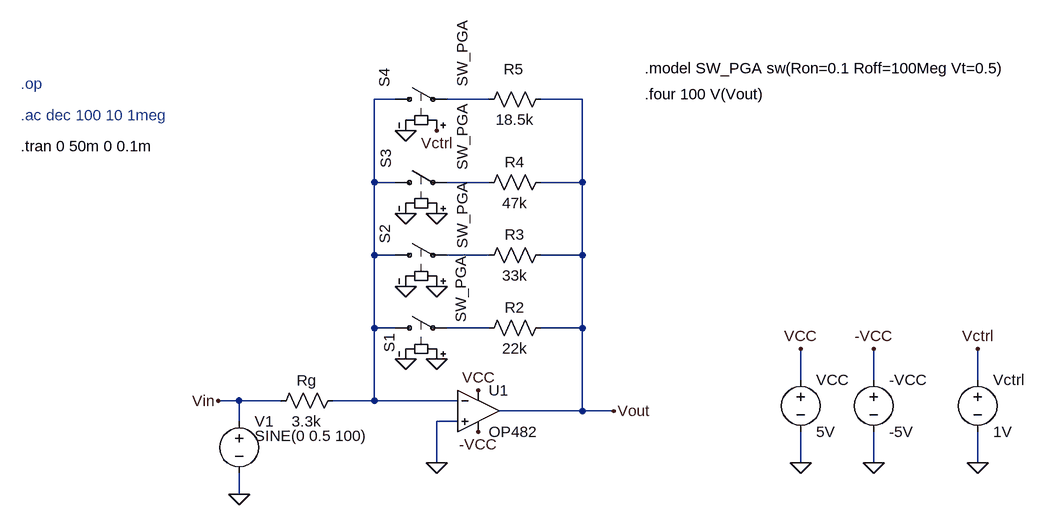
[diagram p0: schematic Etaj3.asc]
Etaj3.asc, the LTspice schematic file:
Version 4
SHEET 1 1272 680
WIRE 240 -96 208 -96
WIRE 384 -96 320 -96
WIRE 528 -96 464 -96
WIRE 208 32 208 -96
WIRE 240 32 208 32
WIRE 384 32 320 32
WIRE 528 32 528 -96
WIRE 528 32 464 32
WIRE 208 144 208 32
WIRE 240 144 208 144
WIRE 384 144 320 144
WIRE 528 144 528 32
WIRE 528 144 464 144
WIRE 208 256 208 144
WIRE 240 256 208 256
WIRE 384 256 320 256
WIRE 528 256 528 144
WIRE 528 256 464 256
WIRE 864 336 864 288
WIRE 976 336 976 288
WIRE 1136 336 1136 288
WIRE 0 368 -32 368
WIRE 64 368 0 368
WIRE 208 368 208 256
WIRE 208 368 144 368
WIRE 336 368 208 368
WIRE 528 384 528 256
WIRE 528 384 400 384
WIRE 576 384 528 384
WIRE 0 400 0 368
WIRE 336 400 304 400
WIRE 304 464 304 400
WIRE 864 464 864 416
WIRE 976 464 976 416
WIRE 1136 464 1136 416
WIRE 0 512 0 480
FLAG 864 464 0
FLAG 976 464 0
FLAG 864 288 VCC
FLAG 368 352 VCC
FLAG 976 288 -VCC
FLAG 368 416 -VCC
FLAG 304 464 0
FLAG 0 512 0
FLAG 1136 464 0
FLAG 1136 288 Vctrl
FLAG 304 -48 Vctrl
FLAG 576 384 Vout
FLAG -32 368 Vin
FLAG 256 -48 0
FLAG 256 80 0
FLAG 256 192 0
FLAG 256 304 0
FLAG 304 304 0
FLAG 304 192 0
FLAG 304 80 0
SYMBOL OP482 368 320 R0
SYMATTR InstName U1
SYMBOL Voltage 864 320 R0
SYMATTR InstName VCC
SYMATTR Value 5V
SYMBOL Voltage 976 320 R0
SYMATTR InstName -VCC
SYMATTR Value -5V
SYMBOL Res 160 352 R90
WINDOW 0 0 56 VBottom 2
WINDOW 3 32 56 VTop 2
SYMATTR InstName Rg
SYMATTR Value 3.3k
SYMBOL Voltage 0 384 R0
WINDOW 3 24 38 Left 2
SYMATTR Value SINE(0 0.5 100)
SYMATTR InstName V1
SYMATTR Value2 AC 1
SYMBOL Res 480 240 R90
WINDOW 0 0 56 VBottom 2
WINDOW 3 32 56 VTop 2
SYMATTR InstName R2
SYMATTR Value 22k
SYMBOL Res 480 128 R90
WINDOW 0 0 56 VBottom 2
WINDOW 3 32 56 VTop 2
SYMATTR InstName R3
SYMATTR Value 33k
SYMBOL Res 480 16 R90
WINDOW 0 0 56 VBottom 2
WINDOW 3 32 56 VTop 2
SYMATTR InstName R4
SYMATTR Value 47k
SYMBOL Res 480 -112 R90
WINDOW 0 -15 58 VBottom 2
WINDOW 3 32 56 VTop 2
SYMATTR InstName R5
SYMATTR Value 18.5k
SYMBOL sw 224 256 R270
WINDOW 0 -38 7 Left 2
WINDOW 3 8 117 Left 2
SYMATTR InstName S1
SYMATTR Value SW_PGA
SYMBOL sw 224 144 R270
WINDOW 0 18 0 Left 2
WINDOW 3 10 119 Left 2
SYMATTR InstName S2
SYMATTR Value SW_PGA
SYMBOL sw 224 32 R270
WINDOW 0 22 2 Left 2
WINDOW 3 19 119 Left 2
SYMATTR InstName S3
SYMATTR Value SW_PGA
SYMBOL sw 224 -96 R270
WINDOW 0 19 -1 Left 2
WINDOW 3 19 119 Left 2
SYMATTR InstName S4
SYMATTR Value SW_PGA
SYMBOL Voltage 1136 320 R0
SYMATTR InstName Vctrl
SYMATTR Value 1V
TEXT 624 -144 Left 2 !.model SW_PGA sw(Ron=0.1 Roff=100Meg Vt=0.5)
TEXT -336 -120 Left 2 ;.op
TEXT -336 -72 Left 2 ;.ac dec 100 10 1meg
TEXT -336 -24 Left 2 !.tran 0 50m 0 0.1m
TEXT 624 -104 Left 2 !.four 100 V(Vout)

The netlist it stands for:
* Etaj3.asc
* U1: OP482 (symbol OP482 not available, pins judged from their places): In+=0 In-=N001 V+=VCC V-=-VCC OUT=Vout
VCC VCC 0 5V
V§-VCC -VCC 0 -5V
Rg N001 Vin 3.3k
V1 Vin 0 SINE(0 0.5 100) AC 1
R2 Vout N005 22k
R3 Vout N004 33k
R4 Vout N003 47k
R5 Vout N002 18.5k
S1 N001 N005 0 0 SW_PGA
S2 N001 N004 0 0 SW_PGA
S3 N001 N003 0 0 SW_PGA
S4 N001 N002 Vctrl 0 SW_PGA
Vctrl Vctrl 0 1V
.model SW_PGA sw(Ron=0.1 Roff=100Meg Vt=0.5)
* .op
* .ac dec 100 10 1meg
.tran 0 50m 0 0.1m
.four 100 V(Vout)
.backanno
.end